# Altium schematic sheet 08 B2B.SchDoc
size A2; ApprovedBy: DNP; CheckedBy: DNP; Author: DNP; CompanyName: Google LLC; DrawnBy: DNP; Organization: Google LLC; Address1: 1600 Amphitheatre Parkway; Address2: Mountain View, CA 94043; Address3: DNP; Address4: DNP; DocumentNumber: 8; SheetNumber: 8; SheetTotal: 17; VersionControl_RevNumber: DNP; IsUserConfigurable: DNP; Time: DNP; ImagePath: DNP; Rule: DNP; ProjectName: Enterprise; Application_BuildNumber: DNP
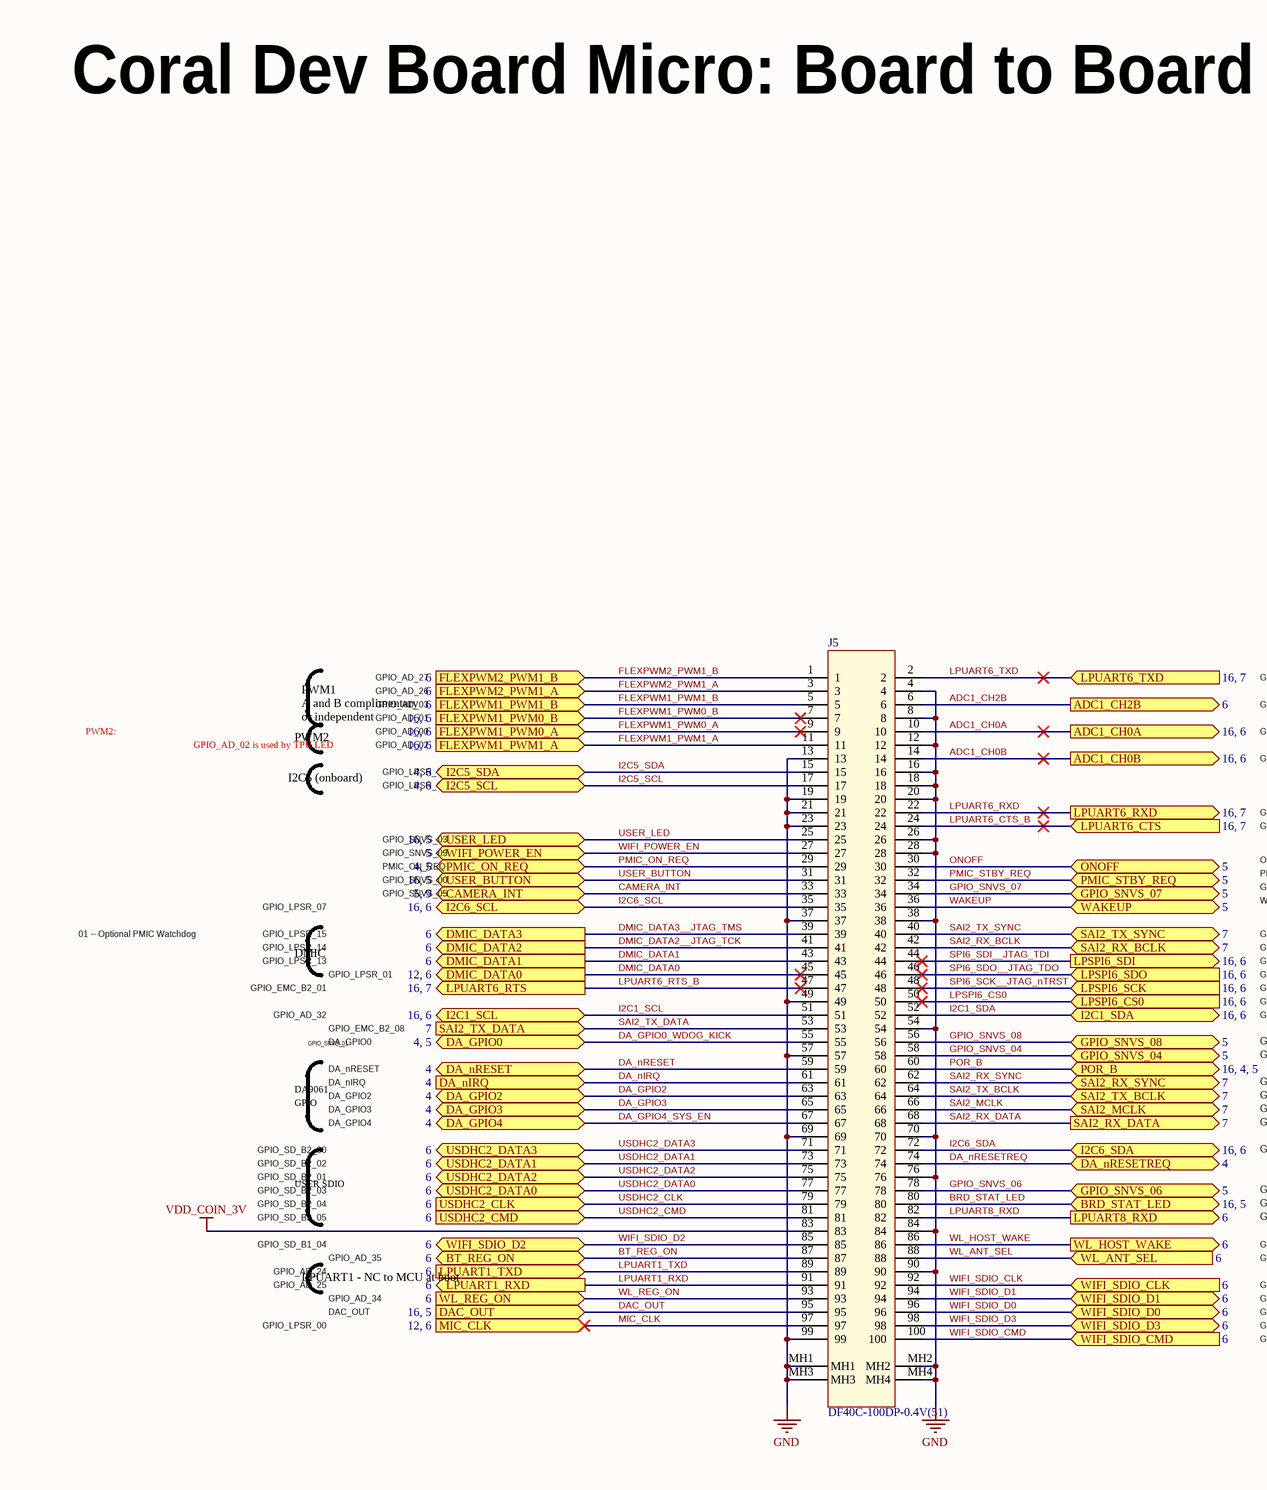
[diagram p0: 08 B2B.SchDoc, left]
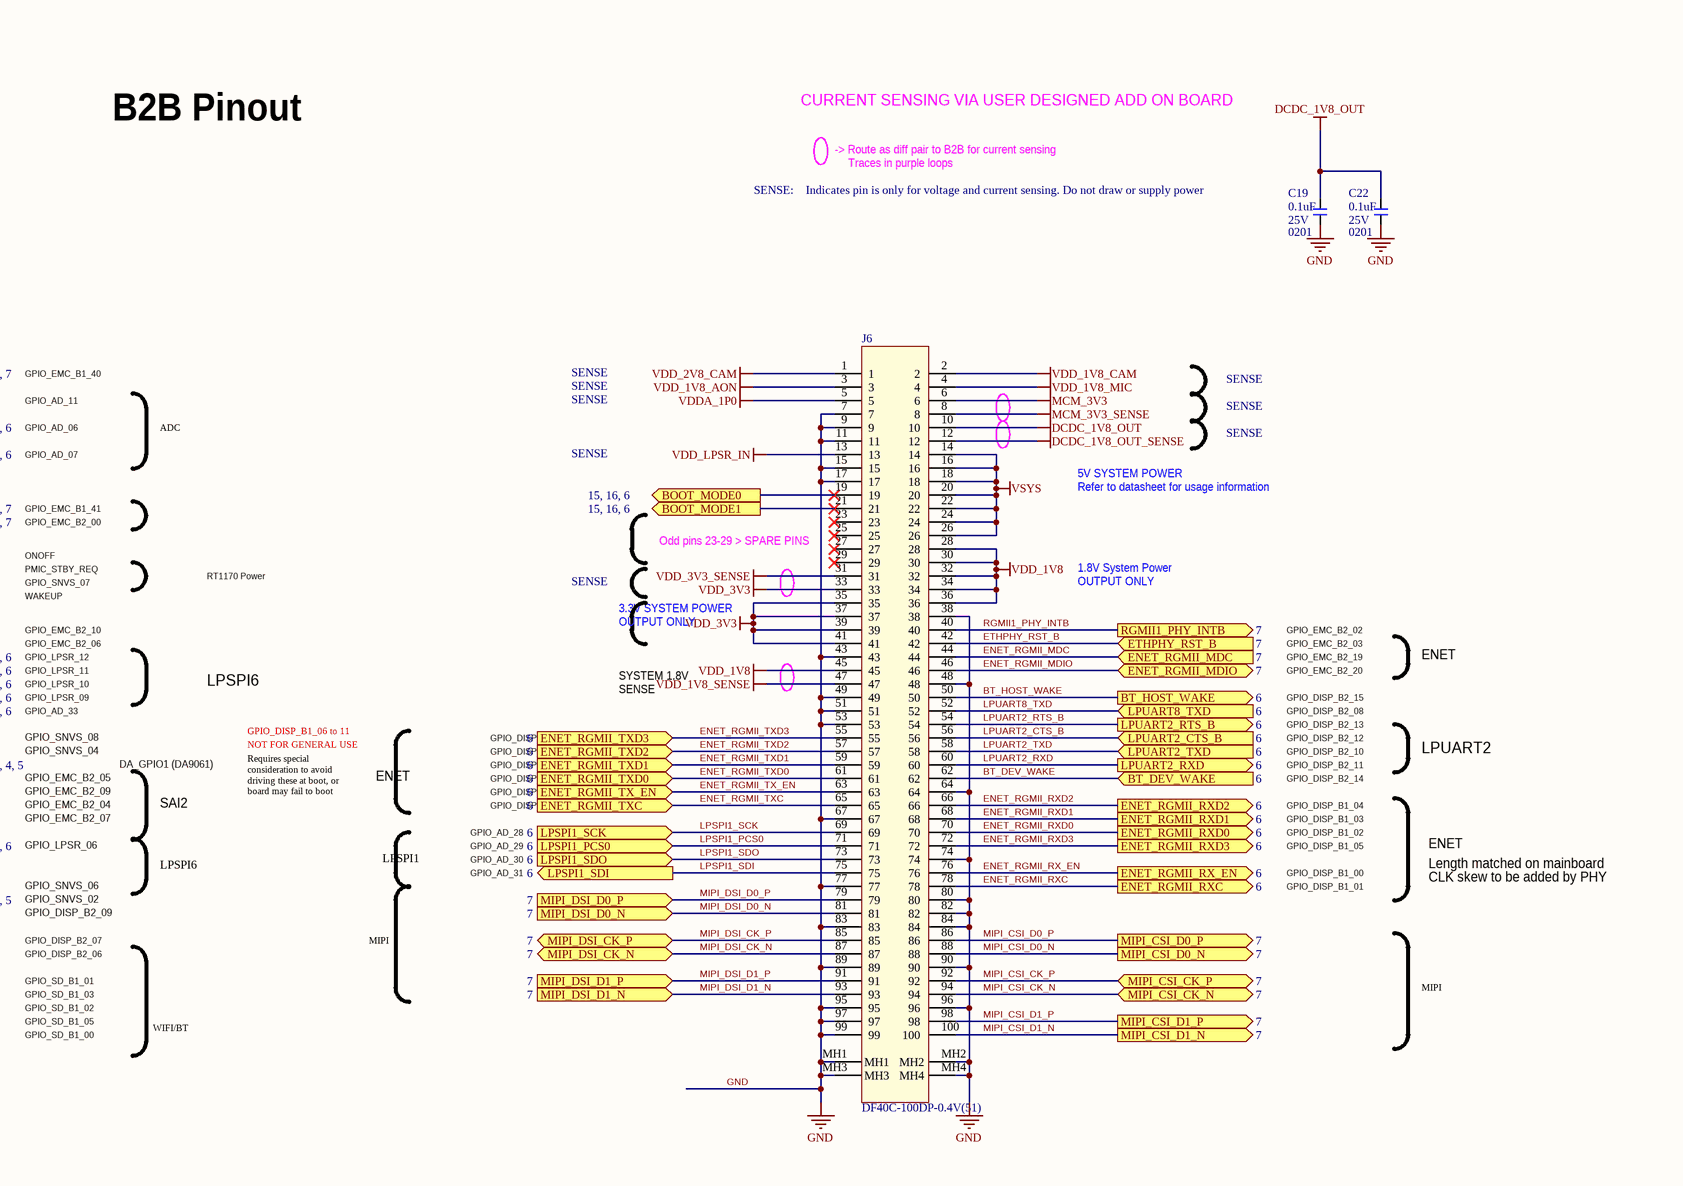
[diagram p1: 08 B2B.SchDoc, right]

## Parts
C19  value 0.1uF  Package: 0201  Voltage: 25V  [C0201Y]  (hidden comment: __Template_Cap)
C22  value 0.1uF  Package: 0201  Voltage: 25V  [C0201Y]  (hidden comment: __Template_Cap)
J5  MFG P/N: DF40C-100DP-0.4V(51)  [HIROSE_DF40C-100DP-0.4V(51)]
J6  MFG P/N: DF40C-100DP-0.4V(51)  [HIROSE_DF40C-100DP-0.4V(51)]

## Ports
ADC1_CH0A (out, see 16, 6), ADC1_CH0B (out, see 16, 6), ADC1_CH2B (out, see 6), BOOT_MODE0 (out, see 15, 16, 6), BOOT_MODE1 (out, see 15, 16, 6), BRD_STAT_LED (bidir, see 16, 5), BT_DEV_WAKE (in, see 6), BT_HOST_WAKE (out, see 6), BT_REG_ON (bidir, see 6), CAMERA_INT (bidir, see 5, 9), DA_GPIO0 (bidir, see 4, 5), DA_GPIO2 (bidir, see 4), DA_GPIO3 (bidir, see 4), DA_GPIO4 (bidir, see 4), DA_nIRQ (in, see 4), DA_nRESET (bidir, see 4), DA_nRESETREQ (bidir, see 4), DAC_OUT (in, see 16, 5), DMIC_DATA0 (out, see 12, 6), DMIC_DATA1 (out, see 6), DMIC_DATA2 (out, see 6), DMIC_DATA3 (out, see 6), ENET_RGMII_MDC (in, see 7), ENET_RGMII_MDIO (bidir, see 7), ENET_RGMII_RX_EN (out, see 6), ENET_RGMII_RXC (out, see 6), ENET_RGMII_RXD0 (out, see 6), ENET_RGMII_RXD1 (out, see 6), ENET_RGMII_RXD2 (out, see 6), ENET_RGMII_RXD3 (out, see 6), ENET_RGMII_TX_EN (in, see 6), ENET_RGMII_TXC (in, see 6), ENET_RGMII_TXD0 (in, see 6), ENET_RGMII_TXD1 (in, see 6), ENET_RGMII_TXD2 (in, see 6), ENET_RGMII_TXD3 (in, see 6), ETHPHY_RST_B (in, see 7), FLEXPWM1_PWM0_A (in, see 16, 6), FLEXPWM1_PWM0_B (in, see 16, 6), FLEXPWM1_PWM1_A (in, see 16, 6), FLEXPWM1_PWM1_B (in, see 6), FLEXPWM2_PWM1_A (in, see 6), FLEXPWM2_PWM1_B (in, see 6), GPIO_SNVS_04 (bidir, see 5), GPIO_SNVS_06 (bidir, see 5), GPIO_SNVS_07 (bidir, see 5), GPIO_SNVS_08 (bidir, see 5), I2C1_SCL (bidir, see 16, 6), I2C1_SDA (bidir, see 16, 6), I2C5_SCL (bidir, see 4, 6), I2C5_SDA (bidir, see 4, 6), I2C6_SCL (bidir, see 16, 6), I2C6_SDA (bidir, see 16, 6), LPSPI1_PCS0 (in, see 6), LPSPI1_SCK (in, see 6), LPSPI1_SDI (out, see 6), LPSPI1_SDO (in, see 6), LPSPI6_CS0 (in, see 16, 6), LPSPI6_SCK (in, see 16, 6), LPSPI6_SDI (out, see 16, 6), LPSPI6_SDO (in, see 16, 6), LPUART1_RXD (out, see 6), LPUART1_TXD (in, see 6), LPUART2_CTS_B (in, see 6), LPUART2_RTS_B (out, see 6), LPUART2_RXD (out, see 6), LPUART2_TXD (in, see 6), LPUART6_CTS (in, see 16, 7), LPUART6_RTS (out, see 16, 7), LPUART6_RXD (out, see 16, 7), LPUART6_TXD (in, see 16, 7), LPUART8_RXD (out, see 6), LPUART8_TXD (in, see 6), MIC_CLK (in, see 12, 6), MIPI_CSI_CK_N (bidir, see 7), MIPI_CSI_CK_P (bidir, see 7), MIPI_CSI_D0_N (out, see 7), MIPI_CSI_D0_P (out, see 7), MIPI_CSI_D1_N (out, see 7), MIPI_CSI_D1_P (out, see 7), MIPI_DSI_CK_N (bidir, see 7), MIPI_DSI_CK_P (bidir, see 7), MIPI_DSI_D0_N (in, see 7), MIPI_DSI_D0_P (in, see 7), MIPI_DSI_D1_N (in, see 7), MIPI_DSI_D1_P (in, see 7), ONOFF (bidir, see 5), PMIC_ON_REQ (bidir, see 4, 5), PMIC_STBY_REQ (bidir, see 5), POR_B (bidir, see 16, 4, 5), RGMII1_PHY_INTB (out, see 7), SAI2_MCLK (bidir, see 7), SAI2_RX_BCLK (bidir, see 7), SAI2_RX_DATA (out, see 7), SAI2_RX_SYNC (bidir, see 7), SAI2_TX_BCLK (bidir, see 7), SAI2_TX_DATA (in, see 7), SAI2_TX_SYNC (bidir, see 7), USDHC2_CLK (in, see 6), USDHC2_CMD (in, see 6), USDHC2_DATA0 (bidir, see 6), USDHC2_DATA1 (bidir, see 6), USDHC2_DATA2 (bidir, see 6), USDHC2_DATA3 (bidir, see 6), USER_BUTTON (bidir, see 16, 5), USER_LED (bidir, see 16, 5), WAKEUP (bidir, see 5), WIFI_POWER_EN (bidir, see 5), WIFI_SDIO_CLK (in, see 6), WIFI_SDIO_CMD (in, see 6), WIFI_SDIO_D0 (bidir, see 6), WIFI_SDIO_D1 (bidir, see 6), WIFI_SDIO_D2 (bidir, see 6), WIFI_SDIO_D3 (bidir, see 6), WL_ANT_SEL (in, see 6), WL_HOST_WAKE (out, see 6), WL_REG_ON (in, see 6)

## Nets
DCDC_1V8_OUT: C19.1 C22.1 J6.10
DCDC_1V8_OUT_SENSE: J6.12
GND: C19.2 C22.2 J5.4 J5.8 J5.12 J5.13 J5.16 J5.18 J5.19 J5.20 J5.21 J5.23 J5.26 J5.28 J5.37 J5.38 J5.49 J5.54 J5.57 J5.69 J5.70 J5.76 J5.84 J5.90 J5.99 J5.MH1 J5.MH2 J5.MH3 J5.MH4 J6.7 J6.9 J6.11 J6.15 J6.17 J6.38 J6.43 J6.48 J6.49 J6.51 J6.53 J6.64 J6.67 J6.74 J6.77 J6.80 J6.82 J6.83 J6.84 J6.89 J6.90 J6.95 J6.96 J6.97 J6.99 J6.MH1 J6.MH2 J6.MH3 J6.MH4
MCM_3V3: J6.6
MCM_3V3_SENSE: J6.8
VDD_1V8: J6.28 J6.30 J6.32 J6.34 J6.36 J6.45
VDD_1V8_AON: J6.3
VDD_1V8_CAM: J6.2
VDD_1V8_MIC: J6.4
VDD_1V8_SENSE: J6.47
VDD_2V8_CAM: J6.1
VDD_3V3: J6.33 J6.35 J6.37 J6.39 J6.41
VDD_3V3_SENSE: J6.31
VDD_COIN_3V: J5.83
VDD_LPSR_IN: J6.13
VDDA_1P0: J6.5
VSYS: J6.14 J6.16 J6.18 J6.20 J6.22 J6.24 J6.26
ADC1_CH0A: J5.10 ; port ADC1_CH0A
ADC1_CH0B: J5.14 ; port ADC1_CH0B
ADC1_CH2B: J5.6 ; port ADC1_CH2B
BOOT_MODE0: J6.19 ; port BOOT_MODE0
BOOT_MODE1: J6.21 ; port BOOT_MODE1
BRD_STAT_LED: J5.80 ; port BRD_STAT_LED
BT_DEV_WAKE: J6.62 ; port BT_DEV_WAKE
BT_HOST_WAKE: J6.50 ; port BT_HOST_WAKE
BT_REG_ON: J5.87 ; port BT_REG_ON
CAMERA_INT: J5.33 ; port CAMERA_INT
DA_GPIO0_WDOG_KICK: J5.55 ; port DA_GPIO0
DA_GPIO2: J5.63 ; port DA_GPIO2
DA_GPIO3: J5.65 ; port DA_GPIO3
DA_GPIO4_SYS_EN: J5.67 ; port DA_GPIO4
DA_nIRQ: J5.61 ; port DA_nIRQ
DA_nRESET: J5.59 ; port DA_nRESET
DA_nRESETREQ: J5.74 ; port DA_nRESETREQ
DAC_OUT: J5.95 ; port DAC_OUT
DMIC_DATA0: J5.45 ; port DMIC_DATA0
DMIC_DATA1: J5.43 ; port DMIC_DATA1
DMIC_DATA2__JTAG_TCK: J5.41 ; port DMIC_DATA2
DMIC_DATA3__JTAG_TMS: J5.39 ; port DMIC_DATA3
ENET_RGMII_MDC: J6.44 ; port ENET_RGMII_MDC
ENET_RGMII_MDIO: J6.46 ; port ENET_RGMII_MDIO
ENET_RGMII_RX_EN: J6.76 ; port ENET_RGMII_RX_EN
ENET_RGMII_RXC: J6.78 ; port ENET_RGMII_RXC
ENET_RGMII_RXD0: J6.70 ; port ENET_RGMII_RXD0
ENET_RGMII_RXD1: J6.68 ; port ENET_RGMII_RXD1
ENET_RGMII_RXD2: J6.66 ; port ENET_RGMII_RXD2
ENET_RGMII_RXD3: J6.72 ; port ENET_RGMII_RXD3
ENET_RGMII_TX_EN: J6.63 ; port ENET_RGMII_TX_EN
ENET_RGMII_TXC: J6.65 ; port ENET_RGMII_TXC
ENET_RGMII_TXD0: J6.61 ; port ENET_RGMII_TXD0
ENET_RGMII_TXD1: J6.59 ; port ENET_RGMII_TXD1
ENET_RGMII_TXD2: J6.57 ; port ENET_RGMII_TXD2
ENET_RGMII_TXD3: J6.55 ; port ENET_RGMII_TXD3
ETHPHY_RST_B: J6.42 ; port ETHPHY_RST_B
FLEXPWM1_PWM0_A: J5.9 ; port FLEXPWM1_PWM0_A
FLEXPWM1_PWM0_B: J5.7 ; port FLEXPWM1_PWM0_B
FLEXPWM1_PWM1_A: J5.11 ; port FLEXPWM1_PWM1_A
FLEXPWM1_PWM1_B: J5.5 ; port FLEXPWM1_PWM1_B
FLEXPWM2_PWM1_A: J5.3 ; port FLEXPWM2_PWM1_A
FLEXPWM2_PWM1_B: J5.1 ; port FLEXPWM2_PWM1_B
GPIO_SNVS_04: J5.58 ; port GPIO_SNVS_04
GPIO_SNVS_06: J5.78 ; port GPIO_SNVS_06
GPIO_SNVS_07: J5.34 ; port GPIO_SNVS_07
GPIO_SNVS_08: J5.56 ; port GPIO_SNVS_08
I2C1_SCL: J5.51 ; port I2C1_SCL
I2C1_SDA: J5.52 ; port I2C1_SDA
I2C5_SCL: J5.17 ; port I2C5_SCL
I2C5_SDA: J5.15 ; port I2C5_SDA
I2C6_SCL: J5.35 ; port I2C6_SCL
I2C6_SDA: J5.72 ; port I2C6_SDA
LPSPI1_PCS0: J6.71 ; port LPSPI1_PCS0
LPSPI1_SCK: J6.69 ; port LPSPI1_SCK
LPSPI1_SDI: J6.75 ; port LPSPI1_SDI
LPSPI1_SDO: J6.73 ; port LPSPI1_SDO
LPSPI6_CS0: J5.50 ; port LPSPI6_CS0
LPUART1_RXD: J5.91 ; port LPUART1_RXD
LPUART1_TXD: J5.89 ; port LPUART1_TXD
LPUART2_CTS_B: J6.56 ; port LPUART2_CTS_B
LPUART2_RTS_B: J6.54 ; port LPUART2_RTS_B
LPUART2_RXD: J6.60 ; port LPUART2_RXD
LPUART2_TXD: J6.58 ; port LPUART2_TXD
LPUART6_CTS_B: J5.24 ; port LPUART6_CTS
LPUART6_RTS_B: J5.47 ; port LPUART6_RTS
LPUART6_RXD: J5.22 ; port LPUART6_RXD
LPUART6_TXD: J5.2 ; port LPUART6_TXD
LPUART8_RXD: J5.82 ; port LPUART8_RXD
LPUART8_TXD: J6.52 ; port LPUART8_TXD
MIC_CLK: J5.97 ; port MIC_CLK
MIPI_CSI_CK_N: J6.94 ; port MIPI_CSI_CK_N
MIPI_CSI_CK_P: J6.92 ; port MIPI_CSI_CK_P
MIPI_CSI_D0_N: J6.88 ; port MIPI_CSI_D0_N
MIPI_CSI_D0_P: J6.86 ; port MIPI_CSI_D0_P
MIPI_CSI_D1_N: J6.100 ; port MIPI_CSI_D1_N
MIPI_CSI_D1_P: J6.98 ; port MIPI_CSI_D1_P
MIPI_DSI_CK_N: J6.87 ; port MIPI_DSI_CK_N
MIPI_DSI_CK_P: J6.85 ; port MIPI_DSI_CK_P
MIPI_DSI_D0_N: J6.81 ; port MIPI_DSI_D0_N
MIPI_DSI_D0_P: J6.79 ; port MIPI_DSI_D0_P
MIPI_DSI_D1_N: J6.93 ; port MIPI_DSI_D1_N
MIPI_DSI_D1_P: J6.91 ; port MIPI_DSI_D1_P
ONOFF: J5.30 ; port ONOFF
PMIC_ON_REQ: J5.29 ; port PMIC_ON_REQ
PMIC_STBY_REQ: J5.32 ; port PMIC_STBY_REQ
POR_B: J5.60 ; port POR_B
RGMII1_PHY_INTB: J6.40 ; port RGMII1_PHY_INTB
SAI2_MCLK: J5.66 ; port SAI2_MCLK
SAI2_RX_BCLK: J5.42 ; port SAI2_RX_BCLK
SAI2_RX_DATA: J5.68 ; port SAI2_RX_DATA
SAI2_RX_SYNC: J5.62 ; port SAI2_RX_SYNC
SAI2_TX_BCLK: J5.64 ; port SAI2_TX_BCLK
SAI2_TX_DATA: J5.53 ; port SAI2_TX_DATA
SAI2_TX_SYNC: J5.40 ; port SAI2_TX_SYNC
SPI6_SCK__JTAG_nTRST: J5.48 ; port LPSPI6_SCK
SPI6_SDI__JTAG_TDI: J5.44 ; port LPSPI6_SDI
SPI6_SDO__JTAG_TDO: J5.46 ; port LPSPI6_SDO
USDHC2_CLK: J5.79 ; port USDHC2_CLK
USDHC2_CMD: J5.81 ; port USDHC2_CMD
USDHC2_DATA0: J5.77 ; port USDHC2_DATA0
USDHC2_DATA1: J5.73 ; port USDHC2_DATA1
USDHC2_DATA2: J5.75 ; port USDHC2_DATA2
USDHC2_DATA3: J5.71 ; port USDHC2_DATA3
USER_BUTTON: J5.31 ; port USER_BUTTON
USER_LED: J5.25 ; port USER_LED
WAKEUP: J5.36 ; port WAKEUP
WIFI_POWER_EN: J5.27 ; port WIFI_POWER_EN
WIFI_SDIO_CLK: J5.92 ; port WIFI_SDIO_CLK
WIFI_SDIO_CMD: J5.100 ; port WIFI_SDIO_CMD
WIFI_SDIO_D0: J5.96 ; port WIFI_SDIO_D0
WIFI_SDIO_D1: J5.94 ; port WIFI_SDIO_D1
WIFI_SDIO_D2: J5.85 ; port WIFI_SDIO_D2
WIFI_SDIO_D3: J5.98 ; port WIFI_SDIO_D3
WL_ANT_SEL: J5.88 ; port WL_ANT_SEL
WL_HOST_WAKE: J5.86 ; port WL_HOST_WAKE
WL_REG_ON: J5.93 ; port WL_REG_ON

Not connected (* = marked no-connect by the designer): J6 23* 25* 27* 29*

## Notes on the sheet
- Coral Dev Board Micro: Board to Board Connector
- B2B Pinout
- CURRENT SENSING VIA USER DESIGNED ADD ON BOARD
- -> Route as diff pair to B2B for current sensing
- (near C19) SENSE:    Indicates pin is only for voltage and current sensing. Do not draw or supply power
- Traces in purple loops
- PWM2:
- PWM1
- A and B complimentary
- or independent
- GPIO_AD_00
- GPIO_AD_01
- GPIO_AD_03
- GPIO_AD_26
- GPIO_AD_27
- GPIO_EMC_B1_40
- GPIO_AD_11
- GPIO_AD_06
- ADC
- SENSE
- GPIO_AD_02 is used by TPU LED
- I2C5 (onboard)
- PWM2
- GPIO_AD_02
- GPIO_LPSR_04
- GPIO_LPSR_05
- GPIO_AD_07
- 5V SYSTEM POWER
- Refer to datasheet for usage information
- GPIO_SNVS_03
- GPIO_SNVS_09
- PMIC_ON_REQ
- GPIO_EMC_B2_00
- GPIO_EMC_B1_41
- ONOFF
- (near J6) Odd pins 23-29 > SPARE PINS
- GPIO_LPSR_07
- GPIO_SNVS_00
- GPIO_SNVS_05
- GPIO_SNVS_07
- WAKEUP
- PMIC_STBY_REQ
- RT1170 Power
- 3.3V SYSTEM POWER
- OUTPUT ONLY
- 1.8V System Power
- 01 -- Optional PMIC Watchdog
- DMIC
- GPIO_EMC_B2_01
- GPIO_LPSR_13
- GPIO_LPSR_14
- GPIO_LPSR_15
- GPIO_LPSR_01
- GPIO_EMC_B2_06
- GPIO_EMC_B2_10
- GPIO_LPSR_09
- GPIO_LPSR_10
- GPIO_LPSR_11
- GPIO_LPSR_12
- LPSPI6
- SYSTEM 1.8V
- GPIO_EMC_B2_02
- GPIO_EMC_B2_19
- GPIO_EMC_B2_20
- GPIO_EMC_B2_03
- GPIO_DISP_B2_15
- ENET
- GPIO_SNVS_01
- GPIO_AD_32
- DA_GPIO0
- GPIO_EMC_B2_08
- GPIO_SNVS_04
- GPIO_AD_33
- GPIO_SNVS_08
- NOT FOR GENERAL USE
- GPIO_DISP_B1_06 to 11
- GPIO_DISP_B1_06
- GPIO_DISP_B1_07
- GPIO_DISP_B2_10
- GPIO_DISP_B2_13
- GPIO_DISP_B2_08
- GPIO_DISP_B2_12
- LPUART2
- DA9061
- GPIO
- DA_GPIO2
- DA_GPIO3
- DA_GPIO4
- DA_nRESET
- DA_nIRQ
- GPIO_EMC_B2_04
- GPIO_EMC_B2_05
- GPIO_EMC_B2_07
- GPIO_EMC_B2_09
- DA_GPIO1 (DA9061)
- SAI2
- Requires special consideration to avoid driving these at boot, or board may fail to boot
- GPIO_AD_28
- GPIO_DISP_B1_08
- GPIO_DISP_B1_09
- GPIO_DISP_B1_10
- GPIO_DISP_B1_11
- GPIO_DISP_B2_11
- GPIO_DISP_B1_02
- GPIO_DISP_B1_03
- GPIO_DISP_B1_04
- GPIO_DISP_B2_14
- USER SDIO
- GPIO_SD_B2_00
- GPIO_SD_B2_01
- GPIO_SD_B2_02
- GPIO_SD_B2_03
- GPIO_SNVS_06
- GPIO_LPSR_06
- LPSPI1
- GPIO_AD_29
- GPIO_AD_30
- GPIO_AD_31
- GPIO_DISP_B1_00
- GPIO_DISP_B1_01
- GPIO_DISP_B1_05
- Length matched on mainboard
- CLK skew to be added by PHY
- GPIO_SD_B1_04
- GPIO_AD_24
- GPIO_SD_B2_04
- GPIO_SD_B2_05
- GPIO_AD_35
- GPIO_SNVS_02
- GPIO_DISP_B2_09
- GPIO_DISP_B2_07
- GPIO_DISP_B2_06
- MIPI
- LPUART1 - NC to MCU at boot
- GPIO_AD_25
- GPIO_LPSR_00
- DAC_OUT
- GPIO_AD_34
- GPIO_SD_B1_01
- GPIO_SD_B1_02
- GPIO_SD_B1_03
- GPIO_SD_B1_05
- WIFI/BT
- GPIO_SD_B1_00
- Project:
- Engineer:
- Date:
- File:
- Revision:
- Sheet
- of

## Library data of the parts
C19 C22 = 386: CAP, CER, X5R, 0.1uF, 25V, 20%, 0201, 0.33mm T; ID: 386; MFG: MURATA; MFG P/N: GRM033R61E104ME14D; XPN: 150-01204-00; Status: Released; Dielectric: X5R; Tolerance: 20%; Height: 0.33mm T; ComponentLink1Description: Datasheet; COMMON: 150-01204-00; LOON: 150-01204-00; Gecko: 150-01204-00
J5 J6 = 897: CONN, HDR, VERT, 2x50, 0.4MM P, 1.14MM H, GOLD, SMD; ID: 897; MFG: Hirose Electric Co Ltd; Connector Type: Plug, Outer Shroud Contacts; Pitch: 0.40mm; Number of Positions: 100; Gender: Male; Status: Released; RoHS Compliant: Yes; Mounting Type: Surface Mount; Orientation: Vertical; Number of Rows: 2; Features: Solder Retention; Supplier 1: Digi-Key; HelpURL: https://www.digikey.com/product-detail/en/hirose-electric-co-ltd/DF40C-100DP-0.4V-51/H11614CT-ND/1969494; ComponentLink1Description: Datasheet; ComponentLink1URL: https://www.hirose.com/product/download/?distributor=digikey&type=2d&lang=en&num=DF40C-100DP-0.4V(51); Supplier Part Number 1: H11614CT-ND